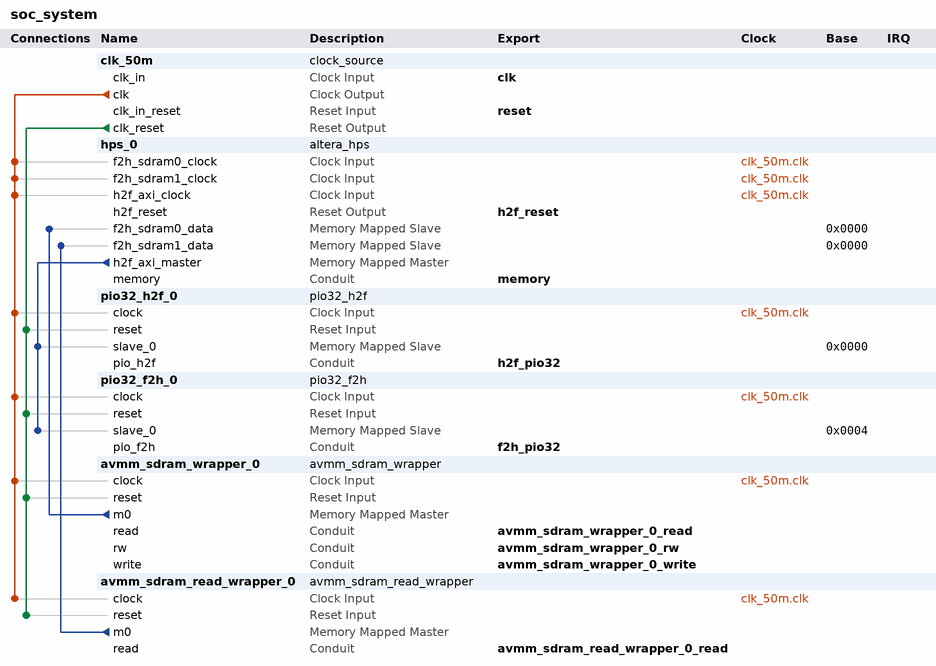
[diagram p0: system contents]
# Platform Designer (Qsys) system soc_system, Cyclone V 5CSEBA6U23I7
# Parameters at their usual value, and those the tool derives, are not listed.
package require -exact qsys 23.1
create_system soc_system
set_project_property DEVICE_FAMILY {Cyclone V}
set_project_property DEVICE 5CSEBA6U23I7

add_instance clk_50m clock_source 23.1
set_instance_parameter_value clk_50m clockFrequency 50000000

add_instance hps_0 altera_hps 23.1
set_instance_parameter_value hps_0 EMAC1_Mode N/A
set_instance_parameter_value hps_0 EMAC1_PinMuxing Unused
set_instance_parameter_value hps_0 F2SCLK_COLDRST_Enable false
set_instance_parameter_value hps_0 F2SCLK_DBGRST_Enable false
set_instance_parameter_value hps_0 F2SCLK_WARMRST_Enable false
set_instance_parameter_value hps_0 F2SDRAM_Type {Avalon-MM Bidirectional,Avalon-MM Read-Only}
set_instance_parameter_value hps_0 F2SDRAM_Width 128,128
set_instance_parameter_value hps_0 F2SINTERRUPT_Enable false
set_instance_parameter_value hps_0 F2S_Width 0
set_instance_parameter_value hps_0 FPGA_PERIPHERAL_OUTPUT_CLOCK_FREQ_EMAC0_GTX_CLK 100
set_instance_parameter_value hps_0 FPGA_PERIPHERAL_OUTPUT_CLOCK_FREQ_EMAC0_MD_CLK 100.0
set_instance_parameter_value hps_0 FPGA_PERIPHERAL_OUTPUT_CLOCK_FREQ_EMAC1_GTX_CLK 100
set_instance_parameter_value hps_0 FPGA_PERIPHERAL_OUTPUT_CLOCK_FREQ_EMAC1_MD_CLK 100.0
set_instance_parameter_value hps_0 HPS_PROTOCOL DDR3
set_instance_parameter_value hps_0 I2C0_Mode N/A
set_instance_parameter_value hps_0 I2C0_PinMuxing Unused
set_instance_parameter_value hps_0 I2C1_Mode N/A
set_instance_parameter_value hps_0 I2C1_PinMuxing Unused
set_instance_parameter_value hps_0 LWH2F_Enable false
set_instance_parameter_value hps_0 MEM_BANKADDR_WIDTH 3
set_instance_parameter_value hps_0 MEM_CLK_FREQ 400.0
set_instance_parameter_value hps_0 MEM_COL_ADDR_WIDTH 10
set_instance_parameter_value hps_0 MEM_DQ_WIDTH 32
set_instance_parameter_value hps_0 MEM_DRV_STR RZQ/6
set_instance_parameter_value hps_0 MEM_ROW_ADDR_WIDTH 15
set_instance_parameter_value hps_0 MEM_RTT_NOM RZQ/6
set_instance_parameter_value hps_0 MEM_RTT_WR {Dynamic ODT off}
set_instance_parameter_value hps_0 MEM_TCL 7
set_instance_parameter_value hps_0 MEM_TFAW_NS 37.5
set_instance_parameter_value hps_0 MEM_TRAS_NS 35.0
set_instance_parameter_value hps_0 MEM_TRCD_NS 13.75
set_instance_parameter_value hps_0 MEM_TRFC_NS 300.0
set_instance_parameter_value hps_0 MEM_TRP_NS 13.75
set_instance_parameter_value hps_0 MEM_VENDOR Other
set_instance_parameter_value hps_0 MEM_WTCL 7
set_instance_parameter_value hps_0 QSPI_Mode N/A
set_instance_parameter_value hps_0 QSPI_PinMuxing Unused
set_instance_parameter_value hps_0 REF_CLK_FREQ 25.0
set_instance_parameter_value hps_0 S2FCLK_USER2CLK 1
set_instance_parameter_value hps_0 S2F_Width 1
set_instance_parameter_value hps_0 SDIO_Mode N/A
set_instance_parameter_value hps_0 SDIO_PinMuxing Unused
set_instance_parameter_value hps_0 SPIM1_Mode N/A
set_instance_parameter_value hps_0 SPIM1_PinMuxing Unused
set_instance_parameter_value hps_0 STM_Enable false
set_instance_parameter_value hps_0 TIMING_BOARD_AC_SKEW 0.02
set_instance_parameter_value hps_0 TIMING_BOARD_AC_TO_CK_SKEW 0.0
set_instance_parameter_value hps_0 TIMING_BOARD_DQ_TO_DQS_SKEW 0.0
set_instance_parameter_value hps_0 TIMING_BOARD_MAX_CK_DELAY 0.6
set_instance_parameter_value hps_0 TIMING_BOARD_MAX_DQS_DELAY 0.6
set_instance_parameter_value hps_0 TIMING_BOARD_SKEW_BETWEEN_DQS 0.02
set_instance_parameter_value hps_0 TIMING_BOARD_SKEW_CKDQS_DIMM_MAX 0.01
set_instance_parameter_value hps_0 TIMING_BOARD_SKEW_CKDQS_DIMM_MIN -0.01
set_instance_parameter_value hps_0 TIMING_BOARD_SKEW_WITHIN_DQS 0.02
set_instance_parameter_value hps_0 TIMING_TDH 125
set_instance_parameter_value hps_0 TIMING_TDQSCK 400
set_instance_parameter_value hps_0 TIMING_TDQSQ 120
set_instance_parameter_value hps_0 TIMING_TDS 50
set_instance_parameter_value hps_0 TIMING_TIH 250
set_instance_parameter_value hps_0 TIMING_TIS 175
set_instance_parameter_value hps_0 TIMING_TQSH 0.38
set_instance_parameter_value hps_0 UART0_Mode N/A
set_instance_parameter_value hps_0 UART0_PinMuxing Unused
set_instance_parameter_value hps_0 USB1_Mode N/A
set_instance_parameter_value hps_0 USB1_PinMuxing Unused
set_instance_parameter_value hps_0 desired_cfg_clk_mhz 100.0
set_instance_parameter_value hps_0 desired_qspi_clk_mhz 370.0

add_instance pio32_h2f_0 pio32_h2f 1.0

add_instance pio32_f2h_0 pio32_f2h 1.0

add_instance avmm_sdram_wrapper_0 avmm_sdram_wrapper 1.0
set_instance_parameter_value avmm_sdram_wrapper_0 SDRAM_DATA_W 128

add_instance avmm_sdram_read_wrapper_0 avmm_sdram_read_wrapper 1.0
set_instance_parameter_value avmm_sdram_read_wrapper_0 SDRAM_DATA_W 128

# connections
add_connection clk_50m.clk avmm_sdram_read_wrapper_0.clock clock
add_connection clk_50m.clk avmm_sdram_wrapper_0.clock clock
add_connection clk_50m.clk hps_0.f2h_sdram0_clock clock
add_connection clk_50m.clk hps_0.f2h_sdram1_clock clock
add_connection clk_50m.clk hps_0.h2f_axi_clock clock
add_connection clk_50m.clk pio32_f2h_0.clock clock
add_connection clk_50m.clk pio32_h2f_0.clock clock
add_connection clk_50m.clk_reset avmm_sdram_read_wrapper_0.reset reset
add_connection clk_50m.clk_reset avmm_sdram_wrapper_0.reset reset
add_connection clk_50m.clk_reset pio32_f2h_0.reset reset
add_connection clk_50m.clk_reset pio32_h2f_0.reset reset
add_connection avmm_sdram_read_wrapper_0.m0 hps_0.f2h_sdram1_data avalon
set_connection_parameter_value avmm_sdram_read_wrapper_0.m0/hps_0.f2h_sdram1_data baseAddress 0x0000
add_connection avmm_sdram_wrapper_0.m0 hps_0.f2h_sdram0_data avalon
set_connection_parameter_value avmm_sdram_wrapper_0.m0/hps_0.f2h_sdram0_data baseAddress 0x0000
add_connection hps_0.h2f_axi_master pio32_f2h_0.slave_0 avalon
set_connection_parameter_value hps_0.h2f_axi_master/pio32_f2h_0.slave_0 baseAddress 0x0004
add_connection hps_0.h2f_axi_master pio32_h2f_0.slave_0 avalon
set_connection_parameter_value hps_0.h2f_axi_master/pio32_h2f_0.slave_0 baseAddress 0x0000

# exported interfaces
add_interface avmm_sdram_read_wrapper_0_read conduit end
set_interface_property avmm_sdram_read_wrapper_0_read EXPORT_OF avmm_sdram_read_wrapper_0.read
add_interface avmm_sdram_wrapper_0_read conduit end
set_interface_property avmm_sdram_wrapper_0_read EXPORT_OF avmm_sdram_wrapper_0.read
add_interface avmm_sdram_wrapper_0_rw conduit end
set_interface_property avmm_sdram_wrapper_0_rw EXPORT_OF avmm_sdram_wrapper_0.rw
add_interface avmm_sdram_wrapper_0_write conduit end
set_interface_property avmm_sdram_wrapper_0_write EXPORT_OF avmm_sdram_wrapper_0.write
add_interface clk clock sink
set_interface_property clk EXPORT_OF clk_50m.clk_in
add_interface f2h_pio32 conduit end
set_interface_property f2h_pio32 EXPORT_OF pio32_f2h_0.pio_f2h
add_interface h2f_pio32 conduit end
set_interface_property h2f_pio32 EXPORT_OF pio32_h2f_0.pio_h2f
add_interface h2f_reset reset source
set_interface_property h2f_reset EXPORT_OF hps_0.h2f_reset
add_interface memory conduit end
set_interface_property memory EXPORT_OF hps_0.memory
add_interface reset reset sink
set_interface_property reset EXPORT_OF clk_50m.clk_in_reset

set_interconnect_requirement {$system} qsys_mm.clockCrossingAdapter HANDSHAKE
set_interconnect_requirement {$system} qsys_mm.maxAdditionalLatency 1

save_system soc_system.qsys
